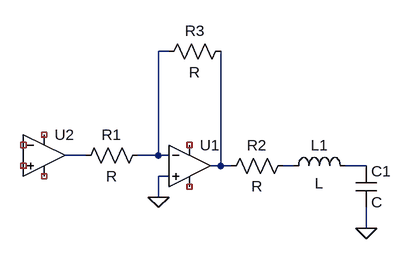
[diagram p0: schematic reto2.asc]
reto2.asc, the LTspice schematic file:
Version 4.1
SHEET 1 880 680
WIRE 464 -48 448 -48
WIRE 336 112 304 112
WIRE 448 112 448 -48
WIRE 448 112 416 112
WIRE 464 112 448 112
WIRE 544 128 544 -48
WIRE 544 128 528 128
WIRE 560 128 544 128
WIRE 656 128 640 128
WIRE 768 128 736 128
WIRE 464 144 448 144
WIRE 448 176 448 144
WIRE 768 224 768 192
FLAG 768 224 0
FLAG 448 176 0
SYMBOL res 432 96 R90
WINDOW 0 0 56 VBottom 2
WINDOW 3 32 56 VTop 2
SYMATTR InstName R1
SYMBOL OpAmps\\UniversalOpAmp2 496 128 R0
SYMATTR InstName U1
SYMBOL OpAmps\\UniversalOpAmp2 272 112 R0
SYMATTR InstName U2
SYMBOL res 656 112 R90
WINDOW 0 0 56 VBottom 2
WINDOW 3 32 56 VTop 2
SYMATTR InstName R2
SYMBOL ind 640 144 R270
WINDOW 0 32 56 VTop 2
WINDOW 3 5 56 VBottom 2
SYMATTR InstName L1
SYMBOL cap 752 128 R0
SYMATTR InstName C1
SYMBOL res 560 -64 R90
WINDOW 0 0 56 VBottom 2
WINDOW 3 32 56 VTop 2
SYMATTR InstName R3

The netlist it stands for:
* reto2.asc
R1 N001 N002 R
X§U1 0 N001 NC_01 NC_02 N003 level2 Avol=1Meg GBW=10Meg Slew=10Meg Ilimit=25m Rail=0 Vos=0 En=0 Enk=0 In=0 Ink=0 Rin=500Meg  ; pins In+ In- V+ V- OUT
X§U2 NC_03 NC_04 NC_05 NC_06 N002 level2 Avol=1Meg GBW=10Meg Slew=10Meg Ilimit=25m Rail=0 Vos=0 En=0 Enk=0 In=0 Ink=0 Rin=500Meg  ; pins In+ In- V+ V- OUT
R2 N004 N003 R
L1 N004 N005 L
C1 N005 0 C
R3 N003 N001 R
.lib UniversalOpAmp2.lib
.backanno
.end